# Altium schematic sheet DSO_Mechanical.SchDoc
size A
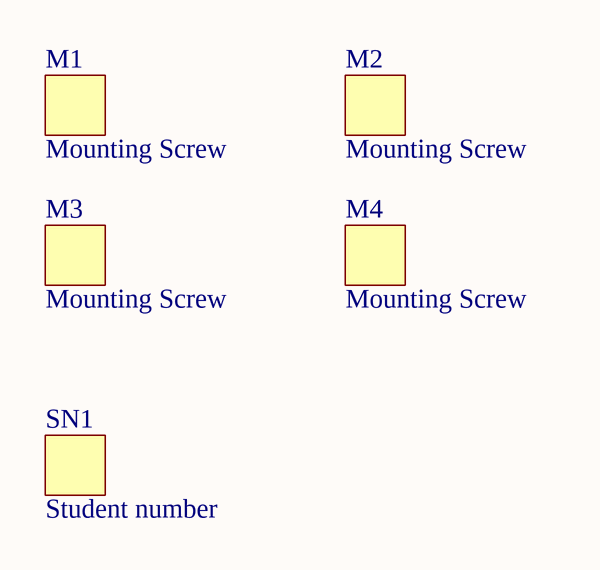
[diagram p0: DSO_Mechanical.SchDoc]

## Parts
M1  Mounting Screw  [MOUNT_SCREW]  (no BOM)
M2  Mounting Screw  [MOUNT_SCREW]  (no BOM)
M3  Mounting Screw  [MOUNT_SCREW]  (no BOM)
M4  Mounting Screw  [MOUNT_SCREW]  (no BOM)
SN1  Student number  [STUDENT NUM]  (no BOM)

## Library data of the parts
SN1 = STUDENT_NUM